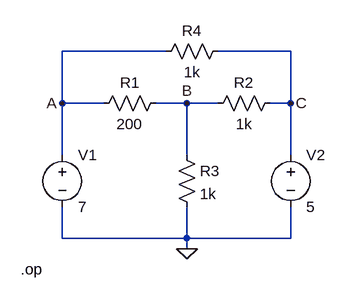
[diagram p0: schematic Lab22.asc]
Lab22.asc, the LTspice schematic file:
Version 4
SHEET 1 880 680
WIRE 224 -80 64 -80
WIRE 416 -80 304 -80
WIRE 64 0 64 -80
WIRE 128 0 64 0
WIRE 256 0 208 0
WIRE 304 0 256 0
WIRE 416 0 416 -80
WIRE 416 0 384 0
WIRE 64 80 64 0
WIRE 256 80 256 0
WIRE 416 80 416 0
WIRE 64 208 64 160
WIRE 256 208 256 160
WIRE 256 208 64 208
WIRE 416 208 416 160
WIRE 416 208 256 208
WIRE 256 224 256 208
FLAG 256 224 0
FLAG 64 0 A
FLAG 256 0 B
FLAG 416 0 C
SYMBOL voltage 64 64 R0
WINDOW 123 0 0 Left 0
WINDOW 39 0 0 Left 0
SYMATTR InstName V1
SYMATTR Value 7
SYMBOL voltage 416 64 R0
SYMATTR InstName V2
SYMATTR Value 5
SYMBOL res 224 -16 R90
WINDOW 0 0 56 VBottom 2
WINDOW 3 32 56 VTop 2
SYMATTR InstName R1
SYMATTR Value 200
SYMBOL res 400 -16 R90
WINDOW 0 0 56 VBottom 2
WINDOW 3 32 56 VTop 2
SYMATTR InstName R2
SYMATTR Value 1k
SYMBOL res 240 64 R0
SYMATTR InstName R3
SYMATTR Value 1k
SYMBOL res 320 -96 R90
WINDOW 0 0 56 VBottom 2
WINDOW 3 32 56 VTop 2
SYMATTR InstName R4
SYMATTR Value 1k
TEXT 0 256 Left 2 !.op

The netlist it stands for:
* Lab22.asc
V1 A 0 7
V2 C 0 5
R1 B A 200
R2 C B 1k
R3 B 0 1k
R4 C A 1k
.op
.backanno
.end